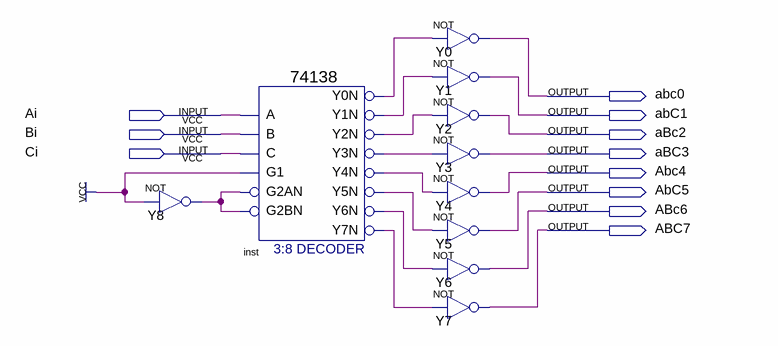
[diagram p0: schematic sheet]
// Quartus schematic Decoder.bdf as structural Verilog: 10 symbols, 11 pins
module Decoder (
  input  Ai,
  input  Bi,
  input  Ci,
  output abc0,
  output abC1,
  output aBc2,
  output aBC3,
  output Abc4,
  output AbC5,
  output ABc6,
  output ABC7
);

  wire inst_y0n, inst_y1n, inst_y2n, inst_y3n, inst_y4n, inst_y5n, inst_y6n, inst_y7n, Y8_out;

  not Y8 (Y8_out, 1'b1);
  \74138  inst (
    .A(Ai), .B(Bi), .G1(1'b1), .C(Ci), .G2AN(Y8_out), .G2BN(Y8_out), .Y0N(inst_y0n), .Y1N(inst_y1n),
    .Y2N(inst_y2n), .Y3N(inst_y3n), .Y4N(inst_y4n), .Y5N(inst_y5n), .Y6N(inst_y6n), .Y7N(inst_y7n));
  not Y0 (abc0, inst_y0n);
  not Y1 (abC1, inst_y1n);
  not Y2 (aBc2, inst_y2n);
  not Y3 (aBC3, inst_y3n);
  not Y4 (Abc4, inst_y4n);
  not Y5 (AbC5, inst_y5n);
  not Y6 (ABc6, inst_y6n);
  not Y7 (ABC7, inst_y7n);
endmodule
